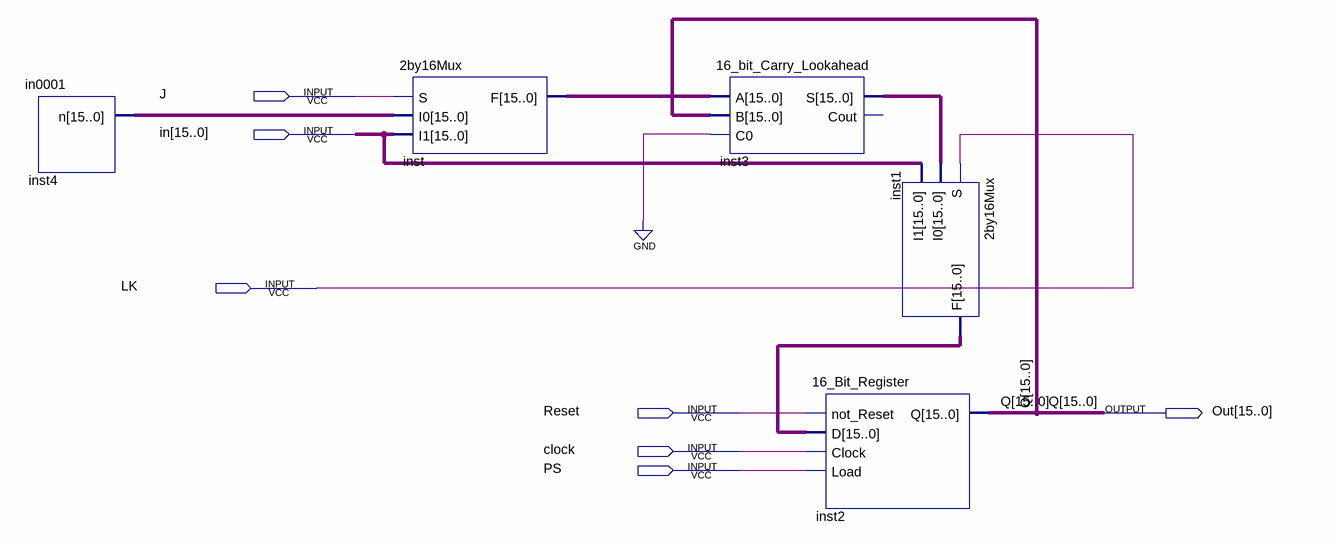
[diagram p0: schematic sheet]
// Quartus schematic Program_counter.bdf as structural Verilog: 5 symbols, 7 pins
module Program_counter (
  input  J,
  input  [15:0] in,
  input  LK,
  input  Reset,
  input  clock,
  input  PS,
  output [15:0] Out
);

  wire [15:0] inst1_f, inst3_s, inst4_n, inst_f;

  in0001 inst4 (.n(inst4_n));
  \2by16Mux  inst (.S(J), .I0(inst4_n), .I1(in), .F(inst_f));
  \16_bit_Carry_Lookahead  inst3 (.A(inst_f), .B(Out), .C0(1'b0), .S(inst3_s));  // open: Cout
  \16_Bit_Register  inst2 (.not_Reset(Reset), .D(inst1_f), .Clock(clock), .Load(PS), .Q(Out));
  \2by16Mux  inst1 (.S(LK), .I0(inst3_s), .I1(in), .F(inst1_f));

  // Other names for the same wires on the sheet: Q[15:0] = Out
endmodule
